# EAGLE design schematic (EAGLE 9.6.2)
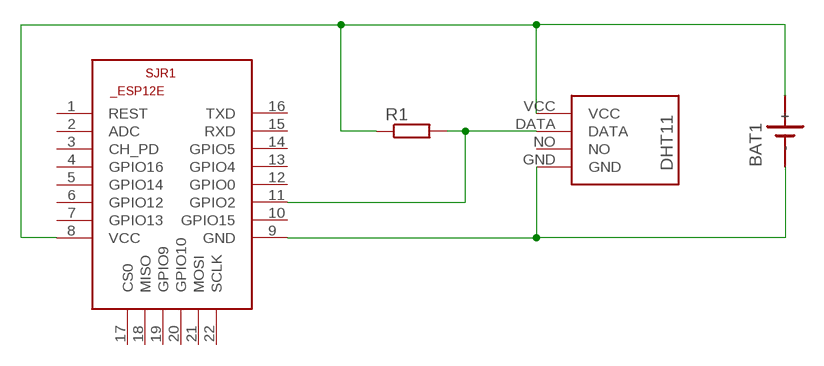
[diagram p0: schematic, sheet 1]

## Parts
BAT1  SN2032  [SN2032]
R1  10 kΩ  R-EU_0207/10  [0207/10]
SJR1  ESP8266-12EESP12E  [ESP8266-ESP12E]
U$2  DHT11  [DHT11]

## Nets
N$1: BAT1.+ R1.1 SJR1.8(VCC) U$2.VCC
N$2: BAT1.- SJR1.9(GND) U$2.GND
N$3: R1.2 SJR1.11(GPIO2) U$2.DATA
Unconnected: SJR1.1(REST) SJR1.2(ADC) SJR1.3(CH_PD) SJR1.4(GPIO16) SJR1.5(GPIO14) SJR1.6(GPIO12) SJR1.7(GPIO13) SJR1.10(GPIO15) SJR1.12(GPIO0) SJR1.13(GPIO4) SJR1.14(GPIO5) SJR1.15(RXD) SJR1.16(TXD) SJR1.17(CS0) SJR1.18(MISO) SJR1.19(GPIO9) SJR1.20(GPIO10) SJR1.21(MOSI) SJR1.22(SCLK) U$2.NO

## Library data of the parts
BAT1 = sn2032:SN2032: LI BATTERY
R1 = rcl:R-EU_: RESISTOR, European symbol; SPICEPREFIX: R
SJR1 = esp12e:ESP8266-12E: ESP8266-12E Library for Eagle CAD The author not responsible for any damages or errors!. Created by Suhail jr.lt;/author>
U$2 = DHT11:DHT11: DHT11 Czujnik temperatury i wilgotności

## Board
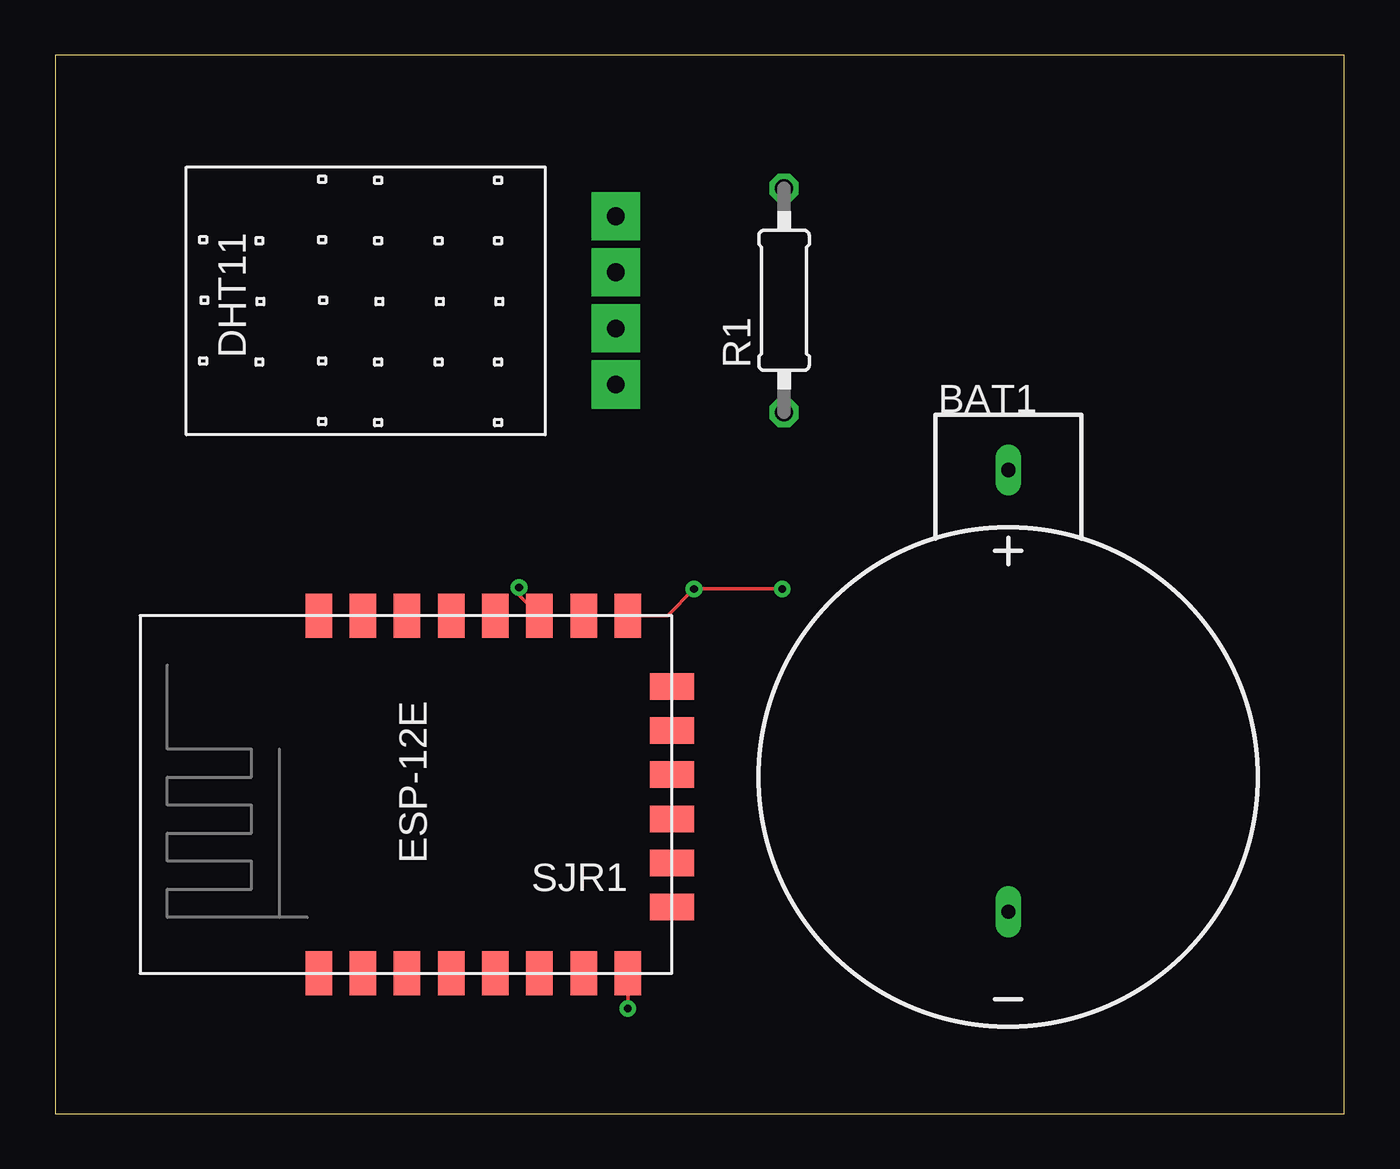
[diagram p1: board, top side]
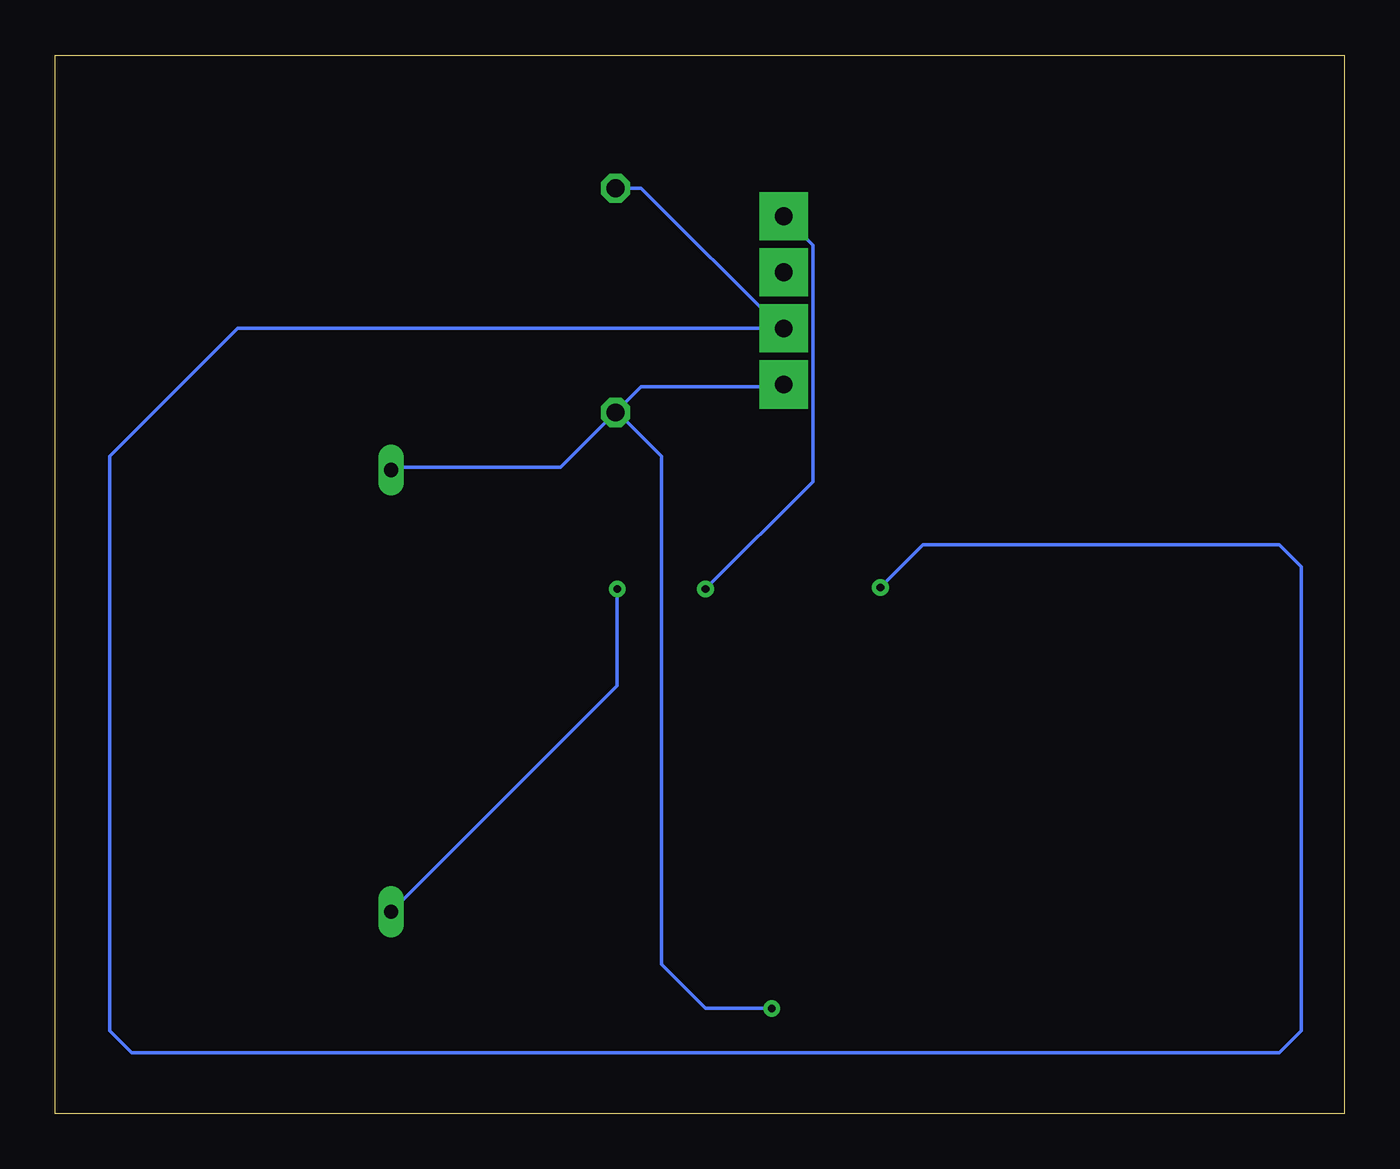
[diagram p2: board, bottom side, seen from below]

Size 58.4 x 47.93 mm. Coordinates in mm from the lower left corner, seen from the top.
Outline: 0,0 58.4,0 58.4,47.93 0,47.93 0,0
Copper layers (1*16): Top 0.035mm / dielectric 1.5mm / Bottom 0.035mm
Design rules "default": minimum track width 6mil, minimum drill 0.35mm, track to track 6mil, track to pad 6mil, pad to pad 6mil, via to via 6mil, smd to smd 6mil, copper to edge 40mil, drill to drill 6mil, minimum pad ring 10mil, minimum via ring 8mil, stop-mask expansion 4mil, vias tented up to drill 0mil, thermal gap 10mil

### Footprints (pad centres in the part's own frame; a part is rotated, then mirrored left to right if it is on the bottom)
SN2032 = drill 0.65 long: + 0,13.9; - 0,-6.1
0207/10 = drill 0.813 octagon: 1 -5.08,0; 2 5.08,0
ESP8266-ESP12E = smd 2 x 1.2: 1 -7.62,5.84; 2 -7.62,3.84; 3 -7.62,1.84; 4 -7.62,-0.16; 5 -7.62,-2.16; 6 -7.62,-4.16; 7 -7.62,-6.16; 8 -7.62,-8.16; 9 8.58,-8.16; 10 8.58,-6.16; 11 8.58,-4.16; 12 8.58,-2.16; 13 8.58,-0.16; 14 8.58,1.84; 15 8.58,3.84; 16 8.58,5.84 | smd 1.2 x 2: 17 -4.62,-10.16; 18 -2.62,-10.16; 19 -0.62,-10.16; 20 1.38,-10.16; 21 3.38,-10.16; 22 5.38,-10.16
DHT11 = drill 0.8 pad 2.184 square: DATA -1.27,-11.43; GND 3.81,-11.43; NO 1.27,-11.43; VCC -3.81,-11.43

### Placement (x,y rotation side)
BAT1  43.18,15.24 0 top
R1  33.02,36.83 90 top
SJR1  17.78,13.97 90 top
U$2  13.97,36.83 90 top

### Tracks (layer width: path | path; a pad name or v marks a point on that pad's centre or on a via)
N$1  (via drill 0.35)
  Top 0.152: SJR1.8 v25.94,4.76
  Bottom 0.152: BAT1.+ 43.13,29.26 35.51,29.26 R1.1 32.97,31.79 | 32.97,31.79 31.85,32.92 25.45,32.92 U$2.VCC | v25.94,4.76 28.94,4.76 30.94,6.76 30.94,29.76 32.97,31.79
N$2  (via drill 0.35)
  Top 0.152: v32.94,23.76 v28.94,23.76 27.73,22.55 SJR1.9
  Bottom 0.152: U$2.GND 24.08,39.32 24.08,28.62 v28.94,23.76 | 43.13,9.14 BAT1.- 32.94,19.38 v32.94,23.76
N$3  (via drill 0.35)
  Top 0.152: v21.01,23.83 21.01,23.48 SJR1.11
  Bottom 0.152: R1.2 31.85,41.91 25.45,35.51 U$2.DATA 50.14,35.56 55.94,29.76 55.94,3.76 54.94,2.76 2.94,2.76 1.94,3.76 1.94,24.76 2.94,25.76 19.08,25.76 v21.01,23.83